# Altium project Radar_labo_EAIII_2025.PrjPcb
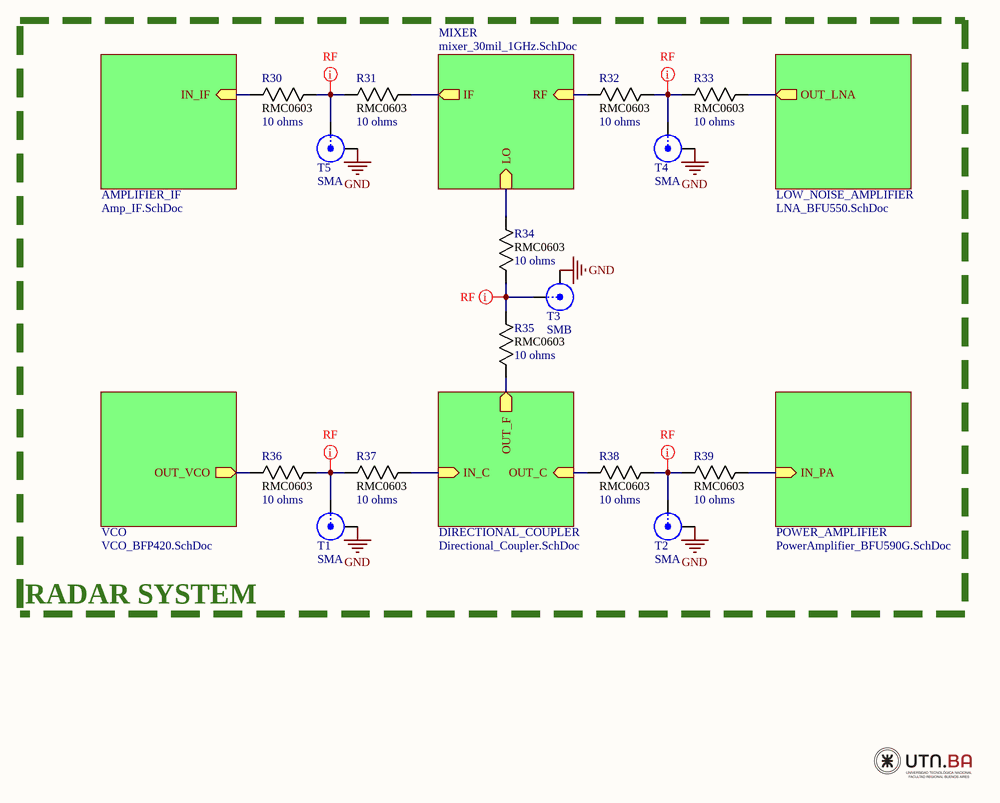
[diagram p0: Completo.SchDoc]
7 sheets, 158 parts. Net scope: hierarchical (ports join the sheet entries above them; power ports are global).
Board file: Radar_1GHz.PcbDoc
Sheets:
  Completo.SchDoc
    VCO = VCO_BFP420.SchDoc
    DIRECTIONAL_COUPLER = Directional_Coupler.SchDoc
    POWER_AMPLIFIER = PowerAmplifier_BFU590G.SchDoc
    AMPLIFIER_IF = Amp_IF.SchDoc
    MIXER = mixer_30mil_1GHz.SchDoc
    LOW_NOISE_AMPLIFIER = LNA_BFU550.SchDoc

## Sheet Completo.SchDoc: RADAR
size A4; Author: Almela; Revision: 1.2; SheetNumber: 1; SheetTotal: 7

### Parts
R30  value 10 ohms  footprint: RMC0603  [RESC1508X55N]  (hidden comment: Resistor)
R31  value 10 ohms  footprint: RMC0603  [RESC1508X55N]  (hidden comment: Resistor)
R32  value 10 ohms  footprint: RMC0603  [RESC1508X55N]  (hidden comment: Resistor)
R33  value 10 ohms  footprint: RMC0603  [RESC1508X55N]  (hidden comment: Resistor)
R34  value 10 ohms  footprint: RMC0603  [RESC1508X55N]  (hidden comment: Resistor)
R35  value 10 ohms  footprint: RMC0603  [RESC1508X55N]  (hidden comment: Resistor)
R36  value 10 ohms  footprint: RMC0603  [RESC1508X55N]  (hidden comment: Resistor)
R37  value 10 ohms  footprint: RMC0603  [RESC1508X55N]  (hidden comment: Resistor)
R38  value 10 ohms  footprint: RMC0603  [RESC1508X55N]  (hidden comment: Resistor)
R39  value 10 ohms  footprint: RMC0603  [RESC1508X55N]  (hidden comment: Resistor)
T1  SMA  [SMA-142-0701-851]
T2  SMA  [SMA-142-0701-851]
T3  SMB  [SMB_V-RJ45]
T4  SMA  [SMA-142-0701-851]
T5  SMA  [SMA-142-0701-851]

### Sub-sheets
AMPLIFIER_IF = Amp_IF.SchDoc: IN_IF (in)
DIRECTIONAL_COUPLER = Directional_Coupler.SchDoc: IN_C (in), OUT_F (out), OUT_C (in)
LOW_NOISE_AMPLIFIER = LNA_BFU550.SchDoc: OUT_LNA (out)
MIXER = mixer_30mil_1GHz.SchDoc: IF (out), RF (in), LO (in)
POWER_AMPLIFIER = PowerAmplifier_BFU590G.SchDoc: IN_PA (in)
VCO = VCO_BFP420.SchDoc: OUT_VCO (out)

### Nets
GND: T1.2(Y) T2.2(Y) T3.2(Y) T4.2(Y) T5.2(Y)
NetC4_1: R32.1 ; sheet MIXER/RF
NetC6_1: R34.2 ; sheet MIXER/LO
NetC9_2: R31.2 ; sheet MIXER/IF
NetC18_1: R36.1 ; sheet VCO/OUT_VCO
NetC27_1: R39.2 ; sheet POWER_AMPLIFIER/IN_PA
NetC37_2: R33.2 ; sheet LOW_NOISE_AMPLIFIER/OUT_LNA
NetC43_1: R37.2 ; sheet DIRECTIONAL_COUPLER/IN_C
NetC50_2: R35.1 ; sheet DIRECTIONAL_COUPLER/OUT_F
NetIN_IF_1: R30.1 ; sheet AMPLIFIER_IF/IN_IF
NetOUT_C_1: R38.1 ; sheet DIRECTIONAL_COUPLER/OUT_C
NetR30_2: R30.2 R31.1 T5.1(X)
NetR32_2: R32.2 R33.1 T4.1(X)
NetR34_1: R34.1 R35.2 T3.1(X)
NetR36_2: R36.2 R37.1 T1.1(X)
NetR38_2: R38.2 R39.1 T2.1(X)

### Layout directives
net class RF50R: NetR30_2, NetR32_2, NetR34_1, NetR36_2, NetR38_2

### Notes on the sheet
- RADAR SYSTEM

### Library data of the parts
R30-R39 = Resistor: Resistor RMC0603; Mfr_Name: Stackpole International
T1-T5 = SMB: SMB Straight Connector; LatestRevisionDate: 17-Jul-2002; LatestRevisionNote: Re-released for DXP Platform.; Publisher: Altium Limited

## Sheet VCO_BFP420.SchDoc: Voltage Controlled Oscillator
size A4; Author: Alemla; Revision: 1.2; SheetNumber: 3; SheetTotal: 7; SPICEModelCacheUMHTQHEF: <root> / <DocumentId>UMHTQHEF</DocumentId> / </root>
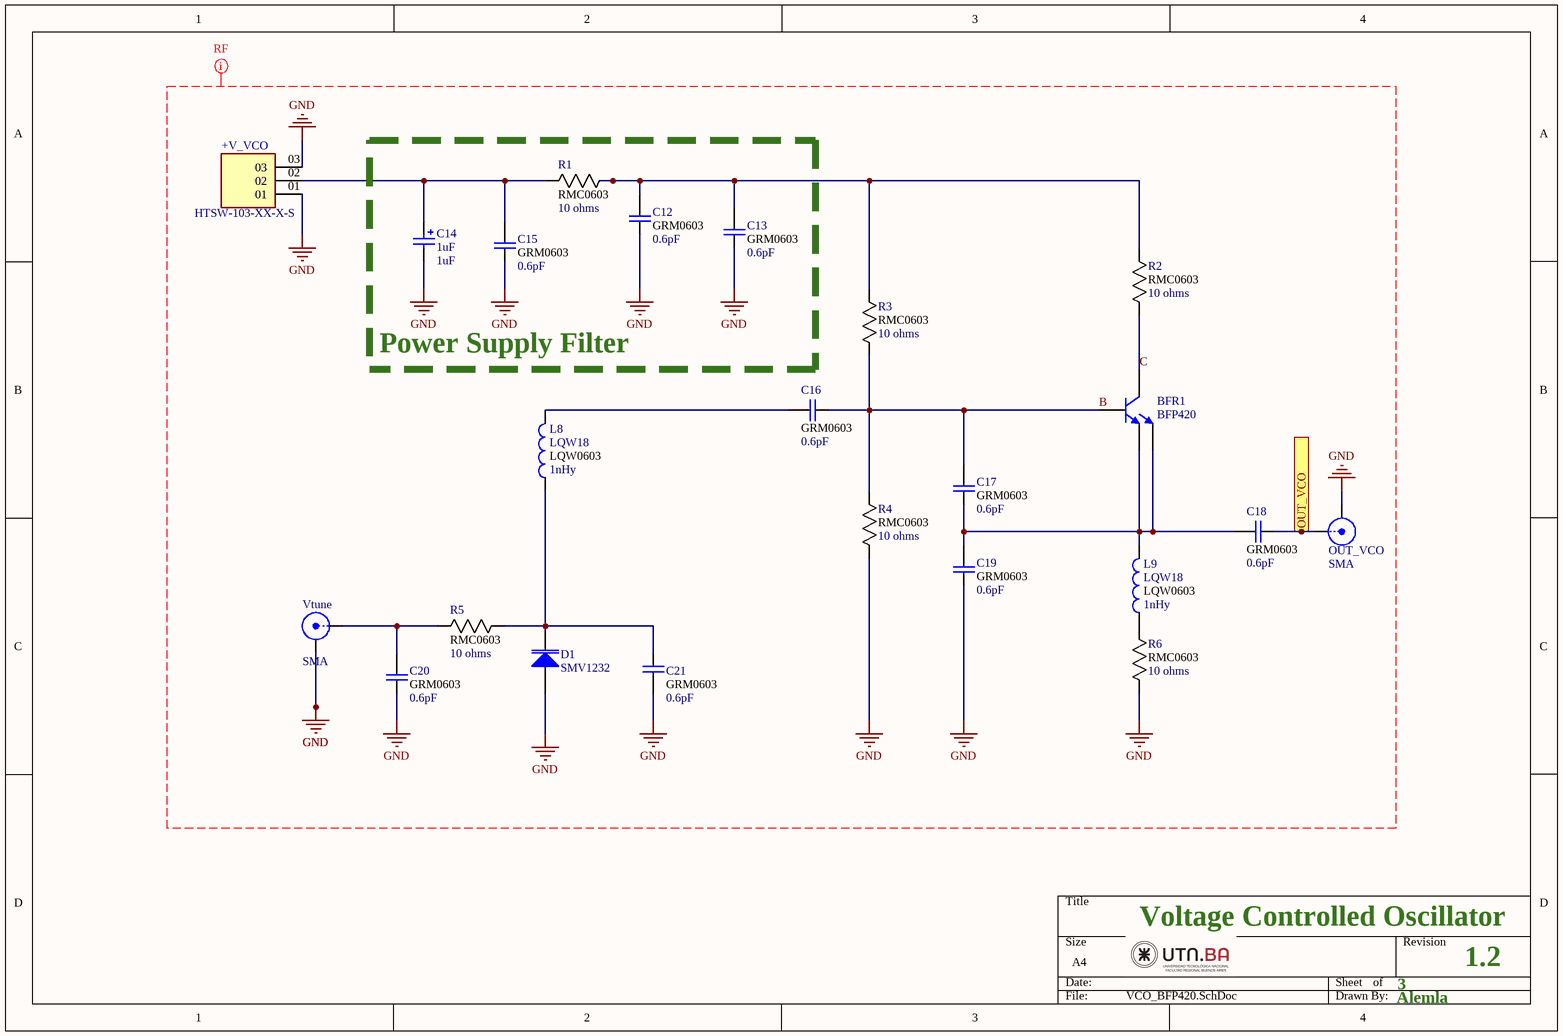
[diagram p1: VCO_BFP420.SchDoc]

### Parts
+V_VCO  HTSW-103-XX-X-S  [SAMTEC_HTSW-103-XX-X-S]
BFR1  BFP420  [SOT-343_N]
C12  value 0.6pF  footprint: GRM0603  [CAPC1608X90N]  (hidden comment: Cap 0603)
C13  value 0.6pF  footprint: GRM0603  [CAPC1608X90N]  (hidden comment: Cap 0603)
C14  1uF  [6-0805_N]
C15  value 0.6pF  footprint: GRM0603  [CAPC1608X90N]  (hidden comment: Cap 0603)
C16  value 0.6pF  footprint: GRM0603  [CAPC1608X90N]  (hidden comment: Cap 0603)
C17  value 0.6pF  footprint: GRM0603  [CAPC1608X90N]  (hidden comment: Cap 0603)
C18  value 0.6pF  footprint: GRM0603  [CAPC1608X90N]  (hidden comment: Cap 0603)
C19  value 0.6pF  footprint: GRM0603  [CAPC1608X90N]  (hidden comment: Cap 0603)
C20  value 0.6pF  footprint: GRM0603  [CAPC1608X90N]  (hidden comment: Cap 0603)
C21  value 0.6pF  footprint: GRM0603  [CAPC1608X90N]  (hidden comment: Cap 0603)
D1  SMV1232  [6-0805_N]
L8  LQW18  value 1nHy  Parameter 1: LQW0603  [INDC1608X100N]
L9  LQW18  value 1nHy  Parameter 1: LQW0603  [INDC1608X100N]
OUT_VCO  SMA  [SMA-142-0701-851]
R1  value 10 ohms  footprint: RMC0603  [RESC1508X55N]  (hidden comment: Resistor)
R2  value 10 ohms  footprint: RMC0603  [RESC1508X55N]  (hidden comment: Resistor)
R3  value 10 ohms  footprint: RMC0603  [RESC1508X55N]  (hidden comment: Resistor)
R4  value 10 ohms  footprint: RMC0603  [RESC1508X55N]  (hidden comment: Resistor)
R5  value 10 ohms  footprint: RMC0603  [RESC1508X55N]  (hidden comment: Resistor)
R6  value 10 ohms  footprint: RMC0603  [RESC1508X55N]  (hidden comment: Resistor)
Vtune  SMA  [SMA-142-0701-851]

### Ports
OUT_VCO (out)

### Nets
GND: +V_VCO.01 +V_VCO.03 C12.1 C13.1 C14.2 C15.1 C19.1 C20.1 C21.2 D1.1(A) OUT_VCO.2(Y) R4.1 R6.1 Vtune.2(Y)
B: BFR1.4(B) C16.1 C17.2 R3.1 R4.2
C: BFR1.2(C) R2.1
Net+V_VCO_02: +V_VCO.02 C14.1 C15.2 R1.1
NetBFR1_1: BFR1.1(E) BFR1.3(E) C17.1 C18.2 C19.2 L9.2
NetC12_2: C12.2 C13.2 R1.2 R2.2 R3.2
NetC16_2: C16.2 L8.2
NetC18_1: C18.1 OUT_VCO.1(X) ; port OUT_VCO
NetC20_2: C20.2 R5.2 Vtune.1(X)
NetC21_1: C21.1 D1.2(K) L8.1 R5.1
NetL9_1: L9.1 R6.2

### Layout directives
net class RF50R: B, C, GND

### Notes on the sheet
- Power Supply Filter

### Library data of the parts
+V_VCO = HTSW-103-XX-X-S: Conn Unshrouded Header HDR 3 POS 2.54mm Solder ST Top Entry Thru-Hole Bag; MP: HTSW-103-08-S-S; MF: Samtec; SnapEDA_Link: https://www.snapeda.com/parts/HTSW-103-08-S-S/Samtec/view-part/?ref=snap; Purchase-URL: https://pricing.snapeda.com/search/part/HTSW-103-08-S-S/?ref=eda; Value: *; Availability: In Stock; Check_prices: https://www.snapeda.com/parts/HTSW-103-08-S-S/Samtec/view-part/?ref=eda; Package: None; Price: None
BFR1 = BFR460: NPN Bipolar Transistor; Published: 8-Jun-2000; LatestRevisionDate: 17-Jul-2002; LatestRevisionNote: Re-released for DXP Platform.; PackageReference: TO-226-AA; Publisher: Altium Limited; PackageDescription: TO, Flat Index; 3 In-Line, Axial Leads; Body Dia. 4.8mm; Leads 0.55 x 0.51 mm (max); Code_JEDEC: TO-226-AA
C12 C13 C15-C21 = Cap: Capacitor GRM18 0603; Published: 8-Jun-2000; LatestRevisionDate: 17-Jul-2002; LatestRevisionNote: Re-released for DXP Platform.; PackageReference: POLAR0.8; Publisher: Altium Limited; PackageDescription: Polarized Capacitor; 2 Leads; Supplier 1: Mouser
C14 = Cap Pol2_1: Polarized Capacitor (Axial); Published: 8-Jun-2000; LatestRevisionDate: 17-Jul-2002; LatestRevisionNote: Re-released for DXP Platform.; PackageReference: POLAR0.8; Publisher: Altium Limited; PackageDescription: Polarized Capacitor; 2 Leads; Value: 1uF
D1 = D Varactor: Variable Capacitance Diode; Note: Pin 2 is not connected and not drawn.; Published: 8-Jun-2000; LatestRevisionDate: 29-May-2009; LatestRevisionNote: IPC-7351 Footprint Added.; DatasheetVersion: Jan-1998; PackageVersion: 1996; PackageReference: SOT23A; Publisher: Altium Limited; PackageDescription: 3-Pin SOT-23 Package 0.95 mm Pitch, 2.3 mm Lead Span - Reverse Pinning; ComponentLink1Description: Manufacturer Link; ComponentLink1URL: http://www.zetex.com/
L8 L9 = LQW18: Ind RF Chip Wirewound 18nH 5% 100MHz 40Q-Factor 550mA 0603 Paper T/R; MP: LQW18AN18NJ00D; Package: None; Price: None; Availability: Unavailable
OUT_VCO Vtune = SMA: SMA Straight Connector; LatestRevisionDate: 17-Jul-2002; LatestRevisionNote: Re-released for DXP Platform.; Publisher: Altium Limited
R1-R6 = Resistor: as R30 on sheet Completo

## Sheet Directional_Coupler.SchDoc: Directional Coupler
size A4; Author: Almela; Revision: 1.2; SheetNumber: 6; SheetTotal: 7
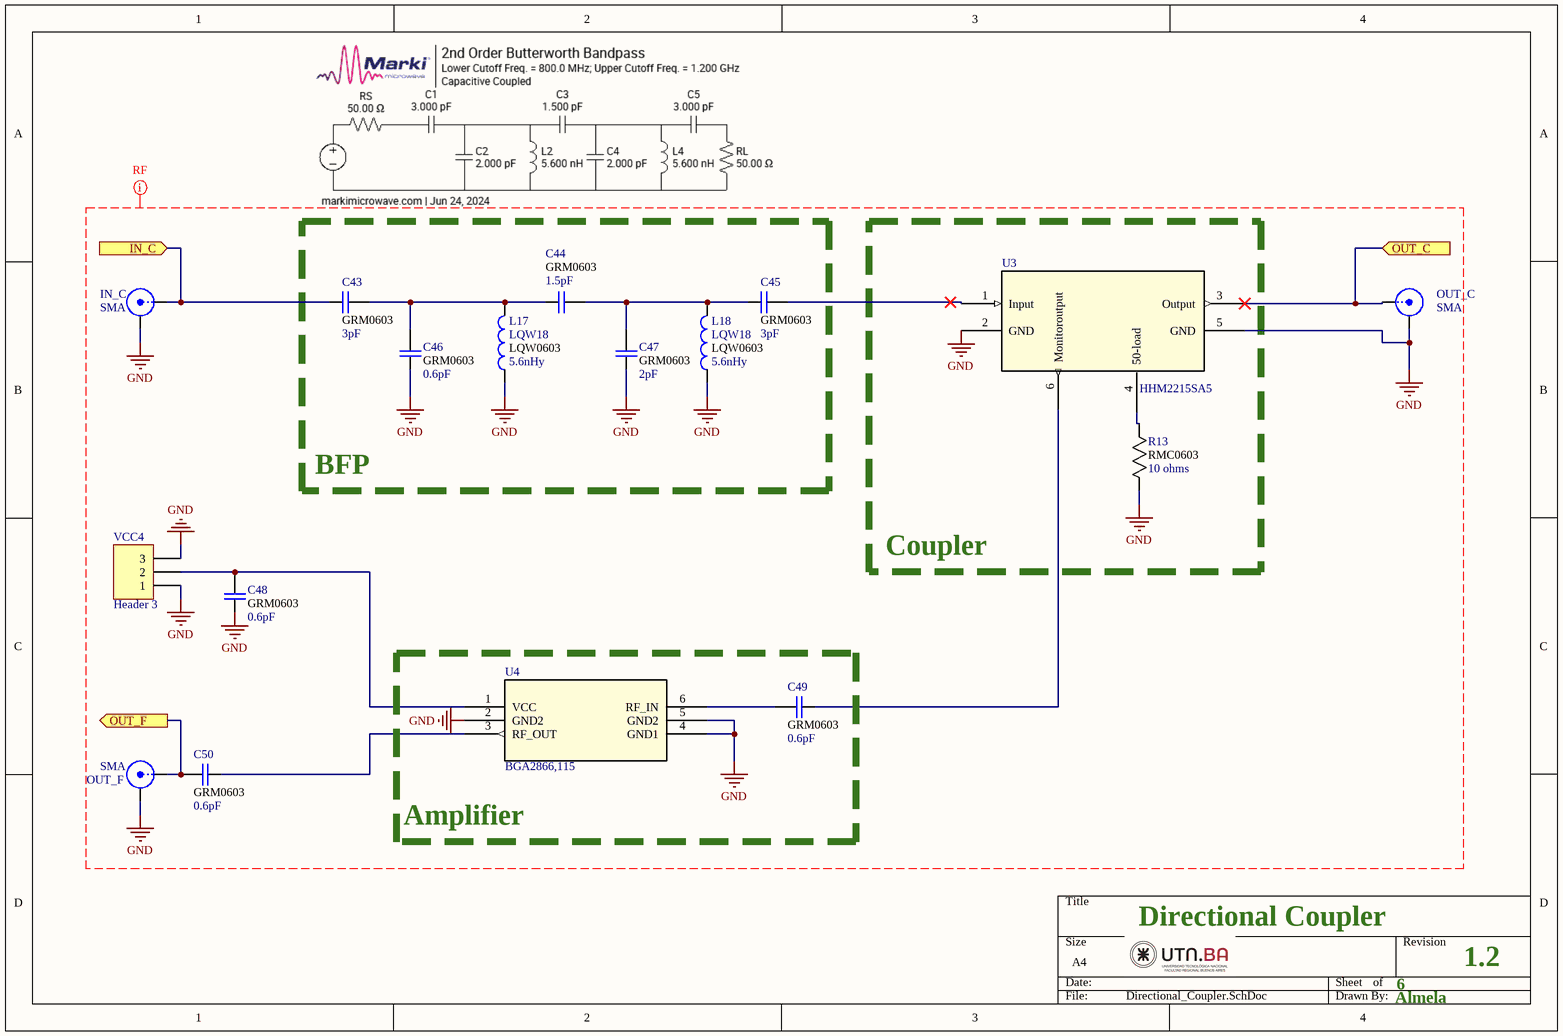
[diagram p2: Directional_Coupler.SchDoc]

### Parts
C43  value 3pF  footprint: GRM0603  [CAPC1608X90N]  (hidden comment: Cap 0603)
C44  value 1.5pF  footprint: GRM0603  [CAPC1608X90N]  (hidden comment: Cap 0603)
C45  value 3pF  footprint: GRM0603  [CAPC1608X90N]  (hidden comment: Cap 0603)
C46  value 0.6pF  footprint: GRM0603  [CAPC1608X90N]  (hidden comment: Cap 0603)
C47  value 2pF  footprint: GRM0603  [CAPC1608X90N]  (hidden comment: Cap 0603)
C48  value 0.6pF  footprint: GRM0603  [CAPC1608X90N]  (hidden comment: Cap 0603)
C49  value 0.6pF  footprint: GRM0603  [CAPC1608X90N]  (hidden comment: Cap 0603)
C50  value 0.6pF  footprint: GRM0603  [CAPC1608X90N]  (hidden comment: Cap 0603)
IN_C  SMA  [SMA-142-0701-851]
L17  LQW18  value 5.6nHy  Parameter 1: LQW0603  [INDC1608X100N]
L18  LQW18  value 5.6nHy  Parameter 1: LQW0603  [INDC1608X100N]
OUT_C  SMA  [SMA-142-0701-851]
OUT_F  SMA  [SMA-142-0701-851]
R13  value 10 ohms  footprint: RMC0603  [RESC1508X55N]  (hidden comment: Resistor)
U3  HHM2215SA5  [HHM-6_1P6X0P8]
U4  BGA2866,115  [SOT363_NXP]
VCC4  Header 3  [HDR1X3]

### Blocks framed on the sheet
BFP: C43-C47 L17 L18
Coupler: R13 U3
Amplifier: C49 U4

### Ports
IN_C (in), OUT_C (in), OUT_F (out)

### Nets
GND: C46.1 C47.1 C48.1 IN_C.2(Y) L17.1 L18.1 OUT_C.2(Y) OUT_F.2(Y) R13.1 U3.2(GND) U3.5(GND) U4.2(GND2) U4.4(GND1) U4.5(GND2) VCC4.1 VCC4.3
NetC43_1: C43.1 IN_C.1(X) ; port IN_C
NetC43_2: C43.2 C44.1 C46.2 L17.2
NetC44_2: C44.2 C45.1 C47.2 L18.2
NetC45_2: C45.2 U3.1(Input)
NetC48_2: C48.2 U4.1(VCC) VCC4.2
NetC49_1: C49.1 U3.6(Monitoroutput)
NetC49_2: C49.2 U4.6(RF_IN)
NetC50_1: C50.1 U4.3(RF_OUT)
NetC50_2: C50.2 OUT_F.1(X) ; port OUT_F
NetOUT_C_1: OUT_C.1(X) U3.3(Output) ; port OUT_C
NetR13_2: R13.2 U3.4(50-load)

### Layout directives
net class RF50R: GND

### Library data of the parts
C43-C50 = Cap: Capacitor GRM18 0603; Published: 8-Jun-2000; LatestRevisionDate: 17-Jul-2002; LatestRevisionNote: Re-released for DXP Platform.; PackageReference: POLAR0.8; Publisher: Altium Limited; PackageDescription: Polarized Capacitor; 2 Leads; Supplier 1: Mouser
IN_C OUT_C = SMA: SMA Straight Connector; LatestRevisionDate: 17-Jul-2002; LatestRevisionNote: Re-released for DXP Platform.; Publisher: Altium Limited
L17 L18 = LQW18: as L8 on sheet VCO_BFP420; Package: None; Price: None; Availability: Unavailable
OUT_F = SMB: SMB Straight Connector; LatestRevisionDate: 17-Jul-2002; LatestRevisionNote: Re-released for DXP Platform.; Publisher: Altium Limited
R13 = Resistor: as R30 on sheet Completo
U3 = HHM2215SA5: No Description Available; Mfr_Name: TDK; RefDes: RefDes; Type: Type
U4 = BGA2866,115: No Description Available; Mfr_Name: NXP; RefDes: RefDes; Type: Type
VCC4 = Header 3: Header, 3-Pin; LatestRevisionDate: 17-Jul-2002; LatestRevisionNote: Re-released for DXP Platform.; Publisher: Altium Limited

## Sheet PowerAmplifier_BFU590G.SchDoc: Power Amplifier
size A4; Author: Almela; Revision: 1.2; SheetNumber: 4; SheetTotal: 7
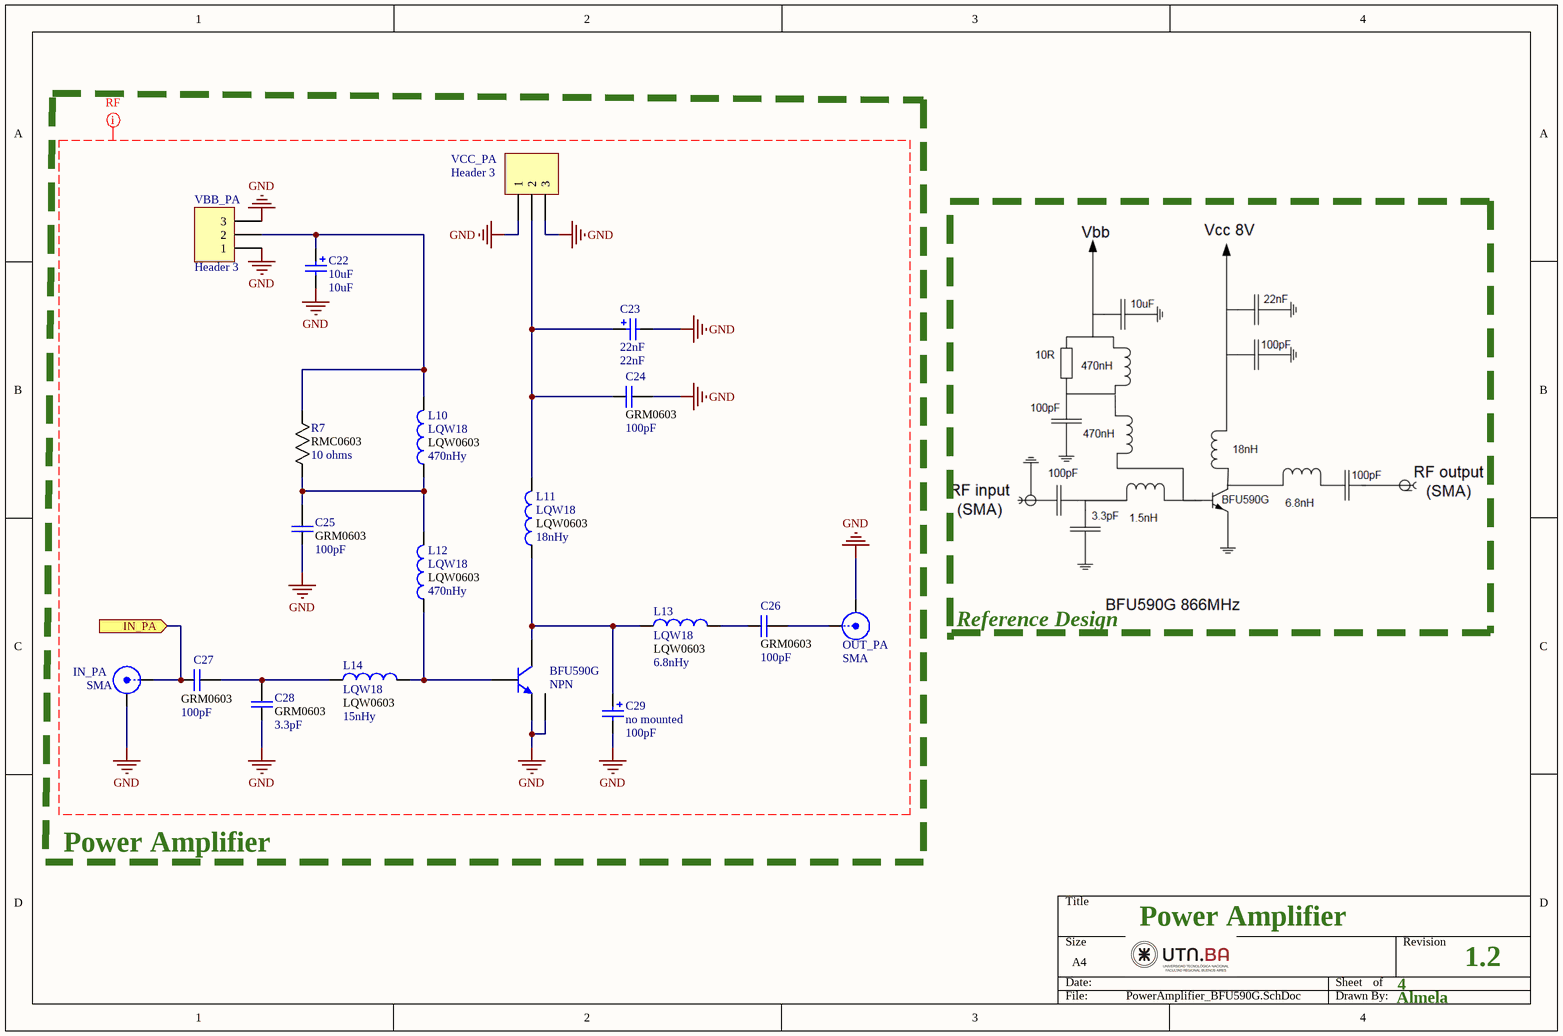
[diagram p3: PowerAmplifier_BFU590G.SchDoc]

### Parts
BFU590G  NPN  [SOT223_L]
C22  10uF  [6-0805_N]
C23  22nF  [6-0805_N]
C24  value 100pF  footprint: GRM0603  [CAPC1608X90N]  (hidden comment: Cap 0603)
C25  value 100pF  footprint: GRM0603  [CAPC1608X90N]  (hidden comment: Cap 0603)
C26  value 100pF  footprint: GRM0603  [CAPC1608X90N]  (hidden comment: Cap 0603)
C27  value 100pF  footprint: GRM0603  [CAPC1608X90N]  (hidden comment: Cap 0603)
C28  value 3.3pF  footprint: GRM0603  [CAPC1608X90N]  (hidden comment: Cap 0603)
C29  no mounted  value 100pF  [6-0805_N]
IN_PA  SMA  [SMA-142-0701-851]
L10  LQW18  value 470nHy  Parameter 1: LQW0603  [INDC1608X100N]
L11  LQW18  value 18nHy  Parameter 1: LQW0603  [INDC1608X100N]
L12  LQW18  value 470nHy  Parameter 1: LQW0603  [INDC1608X100N]
L13  LQW18  value 6.8nHy  Parameter 1: LQW0603  [INDC1608X100N]
L14  LQW18  value 15nHy  Parameter 1: LQW0603  [INDC1608X100N]
OUT_PA  SMA  [SMA-142-0701-851]
R7  value 10 ohms  footprint: RMC0603  [RESC1508X55N]  (hidden comment: Resistor)
VBB_PA  Header 3  [HDR1X3]
VCC_PA  Header 3  [HDR1X3]

### Ports
IN_PA (in)

### Nets
GND: BFU590G.1(E) BFU590G.3(E) C22.2 C23.2 C24.2 C25.1 C28.1 C29.2 IN_PA.2(Y) OUT_PA.2(Y) VBB_PA.1 VBB_PA.3 VCC_PA.1 VCC_PA.3
NetBFU590G_2: BFU590G.2(B) L12.1 L14.2
NetBFU590G_4: BFU590G.4(C) C29.1 L11.1 L13.1
NetC22_1: C22.1 L10.2 R7.2 VBB_PA.2
NetC23_1: C23.1 C24.1 L11.2 VCC_PA.2
NetC25_2: C25.2 L10.1 L12.2 R7.1
NetC26_1: C26.1 L13.2
NetC26_2: C26.2 OUT_PA.1(X)
NetC27_1: C27.1 IN_PA.1(X) ; port IN_PA
NetC27_2: C27.2 C28.2 L14.1

### Layout directives
net class RF50R: GND

### Notes on the sheet
- Reference Design
- Power Amplifier

### Library data of the parts
BFU590G = BFU590G: NPN Bipolar Transistor; Published: 8-Jun-2000; LatestRevisionDate: 17-Jul-2002; LatestRevisionNote: Re-released for DXP Platform.; PackageReference: TO-226-AA; Publisher: Altium Limited; PackageDescription: TO, Flat Index; 3 In-Line, Axial Leads; Body Dia. 4.8mm; Leads 0.55 x 0.51 mm (max); Code_JEDEC: TO-226-AA
C22 = Cap Pol2_7: Polarized Capacitor (Axial); Published: 8-Jun-2000; LatestRevisionDate: 17-Jul-2002; LatestRevisionNote: Re-released for DXP Platform.; PackageReference: POLAR0.8; Publisher: Altium Limited; PackageDescription: Polarized Capacitor; 2 Leads; Value: 10uF
C23 C29 = Cap Pol2_1: Polarized Capacitor (Axial); Published: 8-Jun-2000; LatestRevisionDate: 17-Jul-2002; LatestRevisionNote: Re-released for DXP Platform.; PackageReference: POLAR0.8; Publisher: Altium Limited; PackageDescription: Polarized Capacitor; 2 Leads
  C23: Value: 22nF
C24-C28 = Cap: Capacitor GRM18 0603; Published: 8-Jun-2000; LatestRevisionDate: 17-Jul-2002; LatestRevisionNote: Re-released for DXP Platform.; PackageReference: POLAR0.8; Publisher: Altium Limited; PackageDescription: Polarized Capacitor; 2 Leads; Supplier 1: Mouser
IN_PA OUT_PA = SMA: SMA Straight Connector; LatestRevisionDate: 17-Jul-2002; LatestRevisionNote: Re-released for DXP Platform.; Publisher: Altium Limited
L10-L14 = LQW18: as L8 on sheet VCO_BFP420; Package: None; Price: None; Availability: Unavailable
R7 = Resistor: as R30 on sheet Completo
VBB_PA VCC_PA = Header 3: Header, 3-Pin; LatestRevisionDate: 17-Jul-2002; LatestRevisionNote: Re-released for DXP Platform.; Publisher: Altium Limited

## Sheet Amp_IF.SchDoc: IF Amplifier
size A4; Author: Almela; Revision: 1.2; SheetNumber: 7; SheetTotal: 7
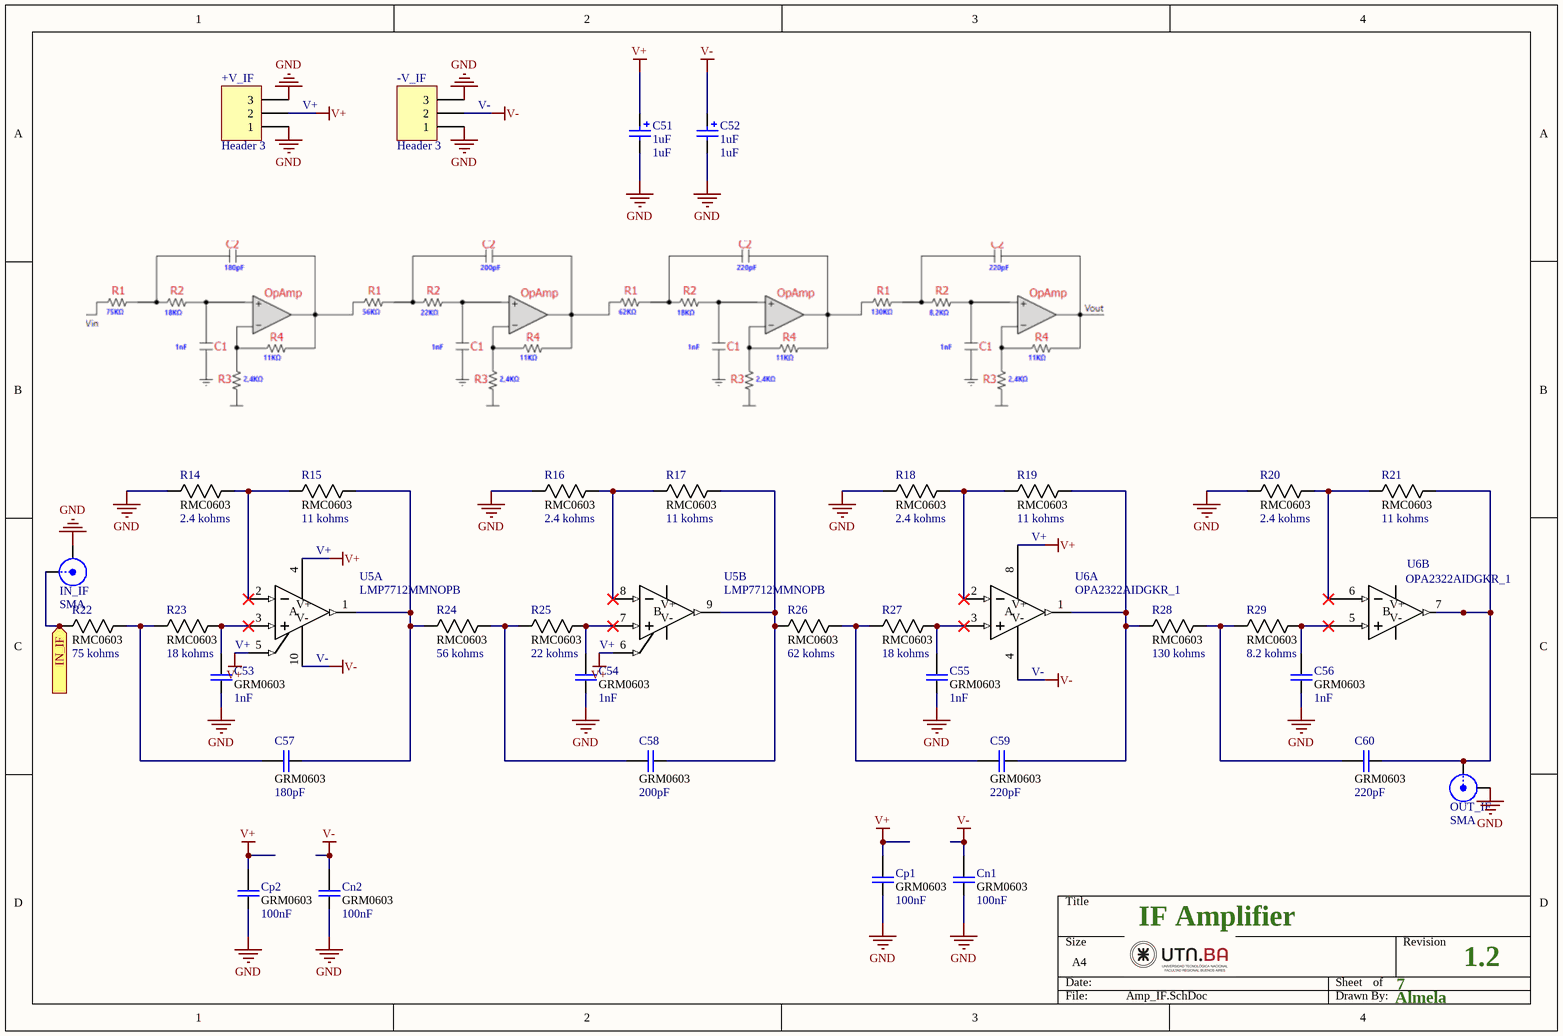
[diagram p4: Amp_IF.SchDoc]

### Parts
+V_IF  Header 3  [HDR1X3]
-V_IF  Header 3  [HDR1X3]
C51  1uF  [6-0805_N]
C52  1uF  [6-0805_N]
C53  value 1nF  footprint: GRM0603  [CAPC1608X90N]  (hidden comment: Cap 0603)
C54  value 1nF  footprint: GRM0603  [CAPC1608X90N]  (hidden comment: Cap 0603)
C55  value 1nF  footprint: GRM0603  [CAPC1608X90N]  (hidden comment: Cap 0603)
C56  value 1nF  footprint: GRM0603  [CAPC1608X90N]  (hidden comment: Cap 0603)
C57  value 180pF  footprint: GRM0603  [CAPC1608X90N]  (hidden comment: Cap 0603)
C58  value 200pF  footprint: GRM0603  [CAPC1608X90N]  (hidden comment: Cap 0603)
C59  value 220pF  footprint: GRM0603  [CAPC1608X90N]  (hidden comment: Cap 0603)
C60  value 220pF  footprint: GRM0603  [CAPC1608X90N]  (hidden comment: Cap 0603)
Cn1  value 100nF  footprint: GRM0603  [CAPC1608X90N]  (hidden comment: Cap 0603)
Cn2  value 100nF  footprint: GRM0603  [CAPC1608X90N]  (hidden comment: Cap 0603)
Cp1  value 100nF  footprint: GRM0603  [CAPC1608X90N]  (hidden comment: Cap 0603)
Cp2  value 100nF  footprint: GRM0603  [CAPC1608X90N]  (hidden comment: Cap 0603)
IN_IF  SMA  [SMA-142-0701-851]
OUT_IF  SMA  [SMA-142-0701-851]
R14  value 2.4 kohms  footprint: RMC0603  [RESC1508X55N]  (hidden comment: Resistor)
R15  value 11 kohms  footprint: RMC0603  [RESC1508X55N]  (hidden comment: Resistor)
R16  value 2.4 kohms  footprint: RMC0603  [RESC1508X55N]  (hidden comment: Resistor)
R17  value 11 kohms  footprint: RMC0603  [RESC1508X55N]  (hidden comment: Resistor)
R18  value 2.4 kohms  footprint: RMC0603  [RESC1508X55N]  (hidden comment: Resistor)
R19  value 11 kohms  footprint: RMC0603  [RESC1508X55N]  (hidden comment: Resistor)
R20  value 2.4 kohms  footprint: RMC0603  [RESC1508X55N]  (hidden comment: Resistor)
R21  value 11 kohms  footprint: RMC0603  [RESC1508X55N]  (hidden comment: Resistor)
R22  value 75 kohms  footprint: RMC0603  [RESC1508X55N]  (hidden comment: Resistor)
R23  value 18 kohms  footprint: RMC0603  [RESC1508X55N]  (hidden comment: Resistor)
R24  value 56 kohms  footprint: RMC0603  [RESC1508X55N]  (hidden comment: Resistor)
R25  value 22 kohms  footprint: RMC0603  [RESC1508X55N]  (hidden comment: Resistor)
R26  value 62 kohms  footprint: RMC0603  [RESC1508X55N]  (hidden comment: Resistor)
R27  value 18 kohms  footprint: RMC0603  [RESC1508X55N]  (hidden comment: Resistor)
R28  value 130 kohms  footprint: RMC0603  [RESC1508X55N]  (hidden comment: Resistor)
R29  value 8.2 kohms  footprint: RMC0603  [RESC1508X55N]  (hidden comment: Resistor)
U5  LMP7712MMNOPB  [SOP50P490X110-10N]  (parts A,B of 2)
U6  OPA2322AIDGKR_1  [DGK8]  (parts A,B of 2)

### Ports
IN_IF (in)

### Nets
GND: +V_IF.1 +V_IF.3 -V_IF.1 -V_IF.3 C51.2 C52.2 C53.1 C54.1 C55.1 C56.1 Cn1.1 Cn2.1 Cp1.1 Cp2.1 IN_IF.2(Y) OUT_IF.2(Y) R14.1 R16.1 R18.1 R20.1
V+: +V_IF.2 C51.1 Cp1.2 Cp2.2 U5.4(V-) U5.5(SD1) U5.6(SD2) U6.8(V+)
V-: -V_IF.2 C52.1 Cn1.2 Cn2.2 U5.10(V+) U6.4(V-)
NetC53_2: C53.2 R23.2 U5.3(IN+)
NetC54_2: C54.2 R25.2 U5.7(IN+)
NetC55_2: C55.2 R27.2 U6.3(IN+)
NetC56_2: C56.2 R29.2 U6.5(INB+)
NetC57_1: C57.1 R15.2 R24.1 U5.1(OUT)
NetC57_2: C57.2 R22.2 R23.1
NetC58_1: C58.1 R17.2 R26.1 U5.9(OUT)
NetC58_2: C58.2 R24.2 R25.1
NetC59_1: C59.1 R19.2 R28.1 U6.1(OUT)
NetC59_2: C59.2 R26.2 R27.1
NetC60_1: C60.1 OUT_IF.1(X) R21.2 U6.7(OUTB)
NetC60_2: C60.2 R28.2 R29.1
NetIN_IF_1: IN_IF.1(X) R22.1 ; port IN_IF
NetR14_2: R14.2 R15.1 U5.2(IN-)
NetR16_2: R16.2 R17.1 U5.8(IN-)
NetR18_2: R18.2 R19.1 U6.2(IN-)
NetR20_2: R20.2 R21.1 U6.6(INB-)

### Notes on the sheet
- (near +V_IF) V+
- (near -V_IF) V-
- (near U5) V+
- V+
- (near U5) V-
- (near U6) V-
- (in symbol LMP7712MMNOPB, part A) A
- (in symbol LMP7712MMNOPB, part B) B
- (in symbol OPA2322AIDGKR_1, part A) A
- (in symbol OPA2322AIDGKR_1, part B) B

### Library data of the parts
+V_IF -V_IF = Header 3: Header, 3-Pin; LatestRevisionDate: 17-Jul-2002; LatestRevisionNote: Re-released for DXP Platform.; Publisher: Altium Limited
C51 C52 = Cap Pol2_1: Polarized Capacitor (Axial); Published: 8-Jun-2000; LatestRevisionDate: 17-Jul-2002; LatestRevisionNote: Re-released for DXP Platform.; PackageReference: POLAR0.8; Publisher: Altium Limited; PackageDescription: Polarized Capacitor; 2 Leads; Value: 1uF
C53-C60 Cn1 Cn2 Cp1 Cp2 = Cap: Capacitor GRM18 0603; Published: 8-Jun-2000; LatestRevisionDate: 17-Jul-2002; LatestRevisionNote: Re-released for DXP Platform.; PackageReference: POLAR0.8; Publisher: Altium Limited; PackageDescription: Polarized Capacitor; 2 Leads; Supplier 1: Mouser
IN_IF OUT_IF = SMA: SMA Straight Connector; LatestRevisionDate: 17-Jul-2002; LatestRevisionNote: Re-released for DXP Platform.; Publisher: Altium Limited
R14-R29 = Resistor: as R30 on sheet Completo
U5 = LMP7712MMNOPB: No Description Available; Mfr_Name: Texas Instruments; Manufacturer: NationalSemiconductor; Characteristics: LMP7712MM18VPrecisonDualLowNoiseCMOSInputOpAmpwithShutdown; CompType: OpAmpIC; TaMin_C: -400; TaMax_C: 1250; ComponentLink1DescBC: LMP7712Datasheet; ComponentLink2DescA4: LMP7712WebPage; ComponentLink3DescAC: MUB10APackageWebPage; SymbolVersion: 2008-07-09; PartNumber: LMP7712MM; PackageDescription: 10LeadMSOP; PackageReference: MUB10A_L; RoHS: O; ComponentLink1URL: http//wwwnationalcom/ds/LM/LMP7712pdf; ComponentLink2URL: http//wwwnationalcom/pf/LM/LMP7712html; ComponentLink3URL: http//wwwnationalcom/packaging/folders/mub10ahtml; Version: B1608; LatestRevisionDate: 2009-03-16; LatestRevisionNote: MassUpdate; Publisher: NationalSemiconductor; Published: 2009-03-16
U6 = OPA2322AIDGKR_1: No Description Available; Mfr_Name: Texas Instruments; RefDes: RefDes; Type: Type

## Sheet mixer_30mil_1GHz.SchDoc: Mixer
size A4; Author: Almela; Revision: 1.2; SheetNumber: 2; SheetTotal: 7
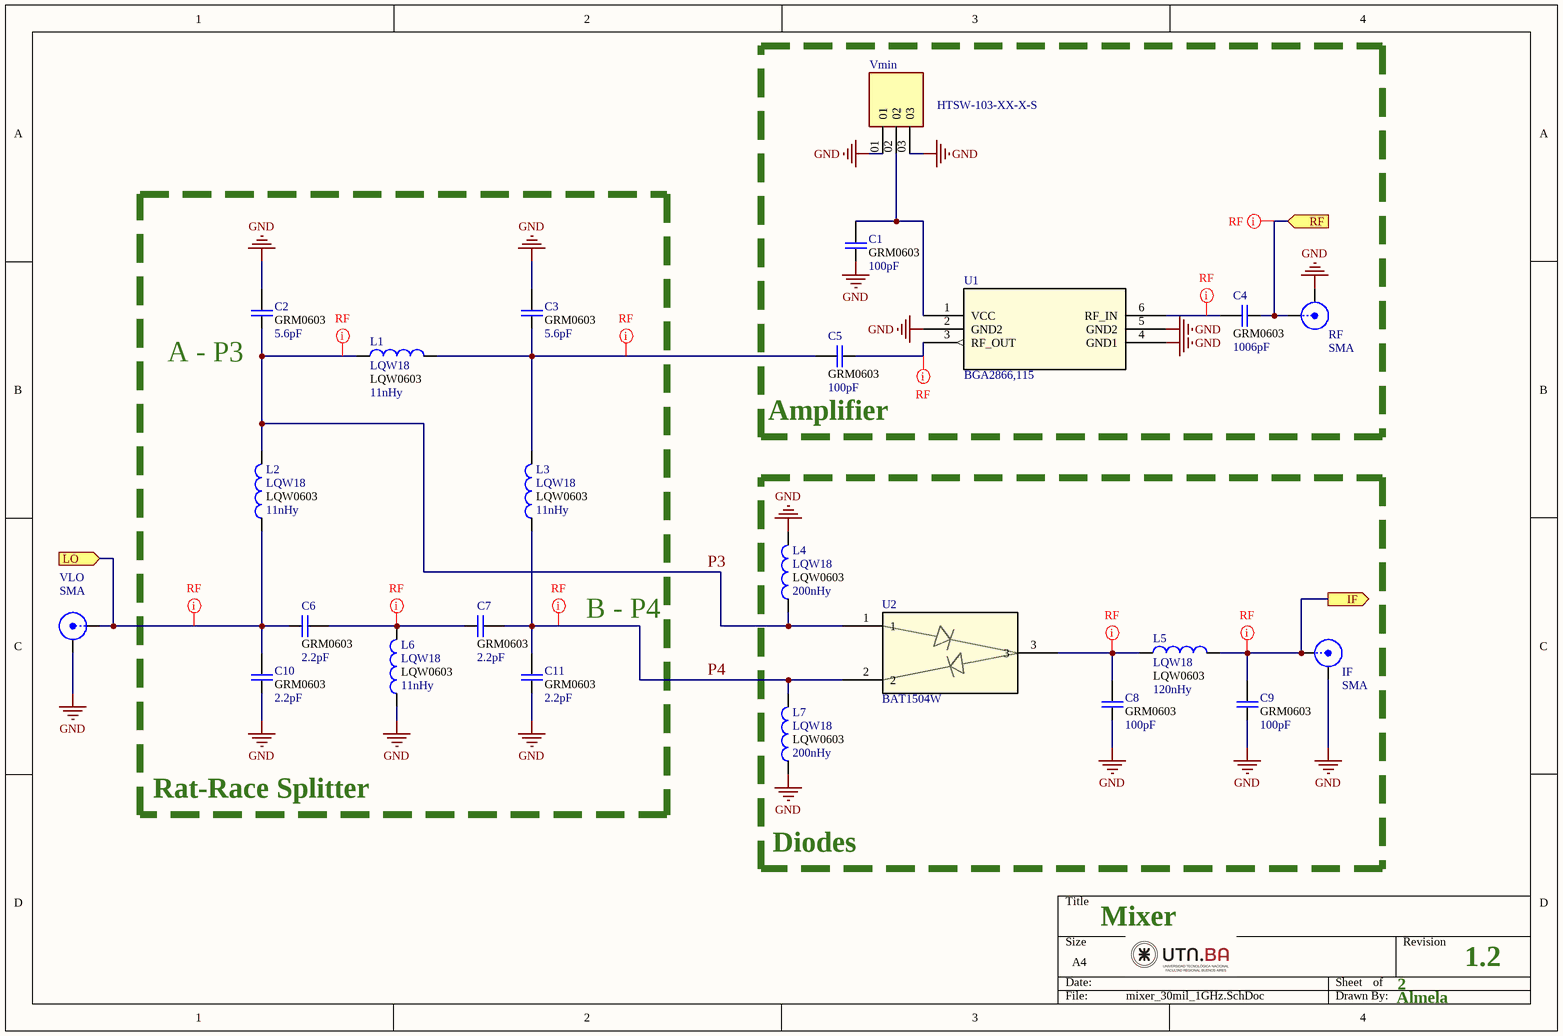
[diagram p5: mixer_30mil_1GHz.SchDoc]

### Parts
C1  value 100pF  footprint: GRM0603  [CAPC1608X90N]  (hidden comment: Cap 0603)
C2  value 5.6pF  footprint: GRM0603  [CAPC1608X90N]  (hidden comment: Cap 0603)
C3  value 5.6pF  footprint: GRM0603  [CAPC1608X90N]  (hidden comment: Cap 0603)
C4  value 1006pF  footprint: GRM0603  [CAPC1608X90N]  (hidden comment: Cap 0603)
C5  value 100pF  footprint: GRM0603  [CAPC1608X90N]  (hidden comment: Cap 0603)
C6  value 2.2pF  footprint: GRM0603  [CAPC1608X90N]  (hidden comment: Cap 0603)
C7  value 2.2pF  footprint: GRM0603  [CAPC1608X90N]  (hidden comment: Cap 0603)
C8  value 100pF  footprint: GRM0603  [CAPC1608X90N]  (hidden comment: Cap 0603)
C9  value 100pF  footprint: GRM0603  [CAPC1608X90N]  (hidden comment: Cap 0603)
C10  value 2.2pF  footprint: GRM0603  [CAPC1608X90N]  (hidden comment: Cap 0603)
C11  value 2.2pF  footprint: GRM0603  [CAPC1608X90N]  (hidden comment: Cap 0603)
IF  SMA  [SMA-142-0701-851]
L1  LQW18  value 11nHy  Parameter 1: LQW0603  [INDC1608X100N]
L2  LQW18  value 11nHy  Parameter 1: LQW0603  [INDC1608X100N]
L3  LQW18  value 11nHy  Parameter 1: LQW0603  [INDC1608X100N]
L4  LQW18  value 200nHy  Parameter 1: LQW0603  [INDC1608X100N]
L5  LQW18  value 120nHy  Parameter 1: LQW0603  [INDC1608X100N]
L6  LQW18  value 11nHy  Parameter 1: LQW0603  [INDC1608X100N]
L7  LQW18  value 200nHy  Parameter 1: LQW0603  [INDC1608X100N]
RF  SMA  [SMA-142-0701-851]
U1  BGA2866,115  [SOT363_NXP]
U2  BAT1504W  [SOT_327XTSA1_INF]
VLO  SMA  [SMA-142-0701-851]
Vmin  HTSW-103-XX-X-S  [SAMTEC_HTSW-103-XX-X-S]

### Blocks framed on the sheet
Amplifier: C1 C4 C5 RF U1 Vmin
Diodes: C8 C9 IF L4 L5 L7 U2

### Ports
IF (out), LO (in), RF (in)

### Nets
GND: C1.1 C2.2 C3.2 C8.1 C9.1 C10.1 C11.1 IF.2(Y) L4.2 L6.1 L7.1 RF.2(Y) U1.2(GND2) U1.4(GND1) U1.5(GND2) VLO.2(Y) Vmin.01 Vmin.03
P3: C2.1 L1.1 L2.2 L4.1 U2.1
P4: C7.2 C11.2 L3.1 L7.2 U2.2
NetC1_2: C1.2 U1.1(VCC) Vmin.02
NetC3_1: C3.1 C5.2 L1.2 L3.2
NetC4_1: C4.1 RF.1(X) ; port RF
NetC4_2: C4.2 U1.6(RF_IN)
NetC5_1: C5.1 U1.3(RF_OUT)
NetC6_1: C6.1 C10.2 L2.1 VLO.1(X) ; port LO
NetC6_2: C6.2 C7.1 L6.2
NetC8_2: C8.2 L5.1 U2.3
NetC9_2: C9.2 IF.1(X) L5.2 ; port IF

### Layout directives
net class RF50R: NetC3_1, NetC4_1, NetC4_2, NetC5_1, NetC6_1, NetC6_2, NetC8_2, NetC9_2, P3, P4

### Notes on the sheet
- (near C2) A - P3
- B - P4
- Rat-Race Splitter

### Library data of the parts
C1-C11 = Cap: Capacitor GRM18 0603; Published: 8-Jun-2000; LatestRevisionDate: 17-Jul-2002; LatestRevisionNote: Re-released for DXP Platform.; PackageReference: POLAR0.8; Publisher: Altium Limited; PackageDescription: Polarized Capacitor; 2 Leads; Supplier 1: Mouser
IF RF VLO = SMB: SMB Straight Connector; LatestRevisionDate: 17-Jul-2002; LatestRevisionNote: Re-released for DXP Platform.; Publisher: Altium Limited
L1-L7 = LQW18: as L8 on sheet VCO_BFP420; Package: None; Price: None; Availability: Unavailable
U1 = BGA2866,115: No Description Available; Mfr_Name: NXP; RefDes: RefDes; Type: Type
U2 = BAT1504W: Diodo; Mfr_Name: Infineon; RefDes: RefDes; Type: Type
Vmin = HTSW-103-XX-X-S: as +V_VCO on sheet VCO_BFP420; SnapEDA_Link: https://www.snapeda.com/parts/HTSW-103-08-S-S/Samtec/view-part/?ref=snap; Purchase-URL: https://pricing.snapeda.com/search/part/HTSW-103-08-S-S/?ref=eda; Value: *; Availability: In Stock; Check_prices: https://www.snapeda.com/parts/HTSW-103-08-S-S/Samtec/view-part/?ref=eda; Package: None; Price: None

## Sheet LNA_BFU550.SchDoc: Low Noise Amplifier
size A4; Author: Almela; Revision: 1.2; SheetNumber: 5; SheetTotal: 7
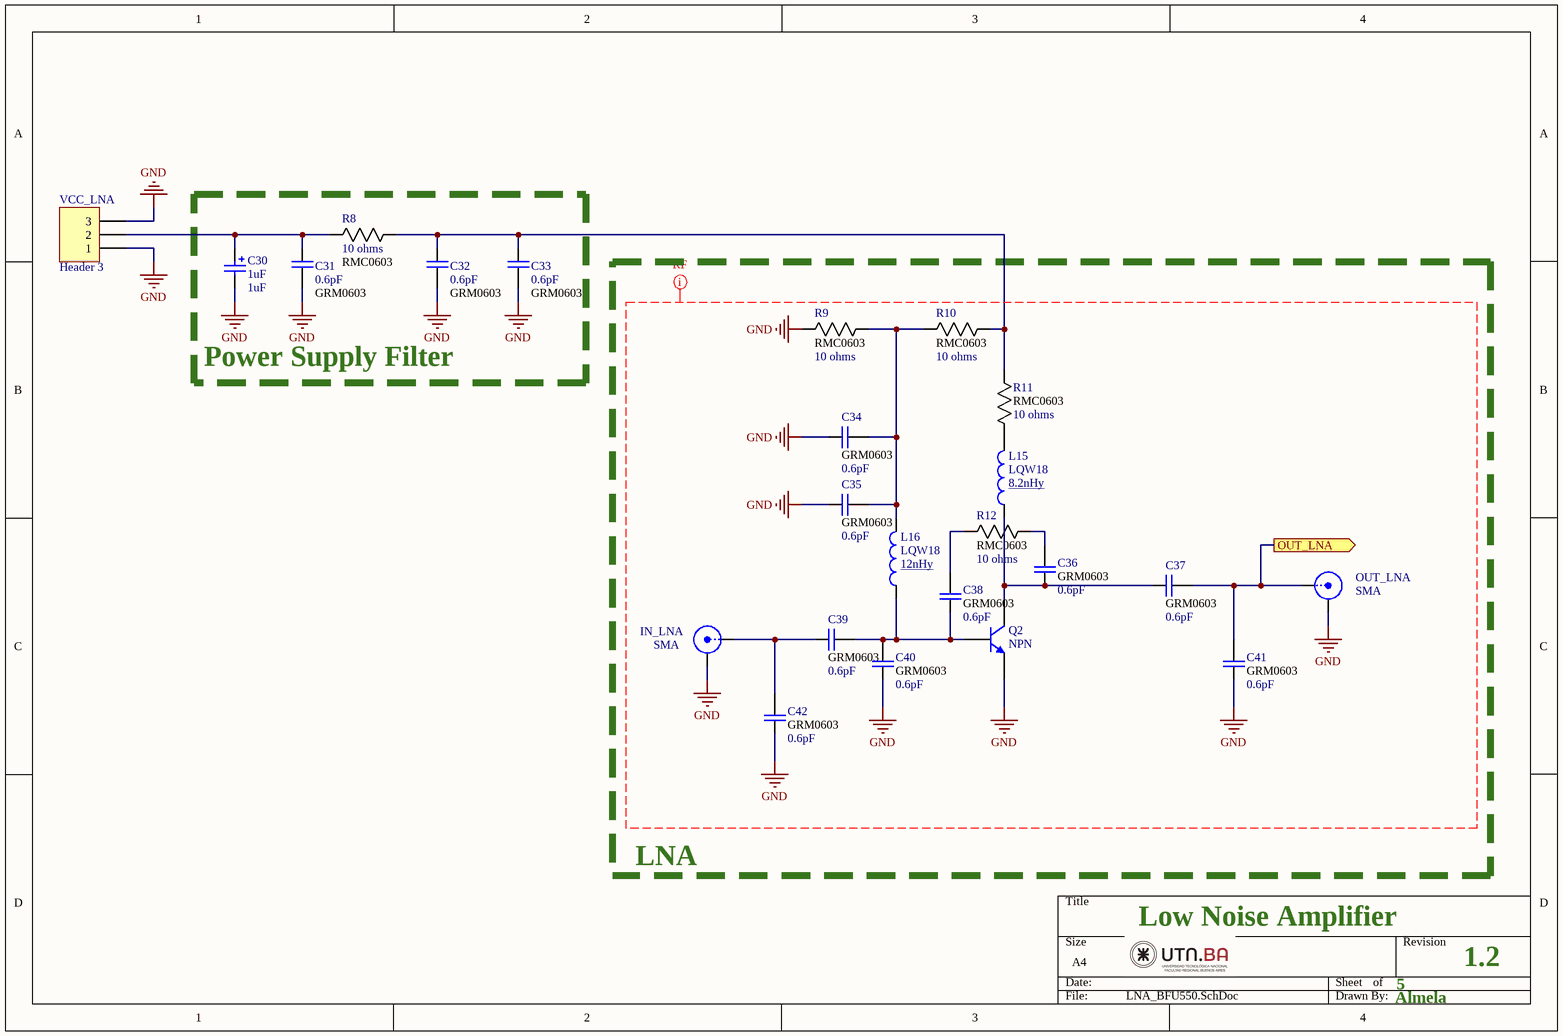
[diagram p6: LNA_BFU550.SchDoc]

### Parts
C30  1uF  [6-0805_N]
C31  value 0.6pF  footprint: GRM0603  [CAPC1608X90N]  (hidden comment: Cap 0603)
C32  value 0.6pF  footprint: GRM0603  [CAPC1608X90N]  (hidden comment: Cap 0603)
C33  value 0.6pF  footprint: GRM0603  [CAPC1608X90N]  (hidden comment: Cap 0603)
C34  value 0.6pF  footprint: GRM0603  [CAPC1608X90N]  (hidden comment: Cap 0603)
C35  value 0.6pF  footprint: GRM0603  [CAPC1608X90N]  (hidden comment: Cap 0603)
C36  value 0.6pF  footprint: GRM0603  [CAPC1608X90N]  (hidden comment: Cap 0603)
C37  value 0.6pF  footprint: GRM0603  [CAPC1608X90N]  (hidden comment: Cap 0603)
C38  value 0.6pF  footprint: GRM0603  [CAPC1608X90N]  (hidden comment: Cap 0603)
C39  value 0.6pF  footprint: GRM0603  [CAPC1608X90N]  (hidden comment: Cap 0603)
C40  value 0.6pF  footprint: GRM0603  [CAPC1608X90N]  (hidden comment: Cap 0603)
C41  value 0.6pF  footprint: GRM0603  [CAPC1608X90N]  (hidden comment: Cap 0603)
C42  value 0.6pF  footprint: GRM0603  [CAPC1608X90N]  (hidden comment: Cap 0603)
IN_LNA  SMA  [SMA-142-0701-851]
L15  LQW18  value 8.2nHy  [INDC1608X100N]
L16  LQW18  value 12nHy  [INDC1608X100N]
OUT_LNA  SMA  [SMA-142-0701-851]
Q2  NPN  [SOT23_N_bfu550a]
R8  value 10 ohms  footprint: RMC0603  [RESC1508X55N]  (hidden comment: Resistor)
R9  value 10 ohms  footprint: RMC0603  [RESC1508X55N]  (hidden comment: Resistor)
R10  value 10 ohms  footprint: RMC0603  [RESC1508X55N]  (hidden comment: Resistor)
R11  value 10 ohms  footprint: RMC0603  [RESC1508X55N]  (hidden comment: Resistor)
R12  value 10 ohms  footprint: RMC0603  [RESC1508X55N]  (hidden comment: Resistor)
VCC_LNA  Header 3  [HDR1X3]

### Blocks framed on the sheet
Power Supply Filter: C30-C33 R8

### Ports
OUT_LNA (out)

### Nets
GND: C30.2 C31.2 C32.2 C33.2 C34.1 C35.1 C40.1 C41.1 C42.1 IN_LNA.2(Y) OUT_LNA.2(Y) Q2.2(E) R9.2 VCC_LNA.1 VCC_LNA.3
NetC30_1: C30.1 C31.1 R8.2 VCC_LNA.2
NetC32_1: C32.1 C33.1 R8.1 R10.2 R11.2
NetC34_2: C34.2 C35.2 L16.2 R9.1 R10.1
NetC36_1: C36.1 C37.1 L15.1 Q2.3(C)
NetC36_2: C36.2 R12.2
NetC37_2: C37.2 C41.2 OUT_LNA.1(X) ; port OUT_LNA
NetC38_1: C38.1 C39.2 C40.2 L16.1 Q2.1(B)
NetC38_2: C38.2 R12.1
NetC39_1: C39.1 C42.2 IN_LNA.1(X)
NetL15_2: L15.2 R11.1

### Layout directives
net class RF50R: GND

### Notes on the sheet
- LNA

### Library data of the parts
C30 = Cap Pol2_1: Polarized Capacitor (Axial); Published: 8-Jun-2000; LatestRevisionDate: 17-Jul-2002; LatestRevisionNote: Re-released for DXP Platform.; PackageReference: POLAR0.8; Publisher: Altium Limited; PackageDescription: Polarized Capacitor; 2 Leads; Value: 1uF
C31-C42 = Cap: Capacitor GRM18 0603; Published: 8-Jun-2000; LatestRevisionDate: 17-Jul-2002; LatestRevisionNote: Re-released for DXP Platform.; PackageReference: POLAR0.8; Publisher: Altium Limited; PackageDescription: Polarized Capacitor; 2 Leads; Supplier 1: Mouser
IN_LNA OUT_LNA = SMB: SMB Straight Connector; LatestRevisionDate: 17-Jul-2002; LatestRevisionNote: Re-released for DXP Platform.; Publisher: Altium Limited
L15 L16 = LQW18_1: Inductor LQW Package: 0603 (1608); MP: LQW18ANR47J00D; MF: Murata; Arrow_Electronics-Purchase-URL: https://snapeda.com/shop?store=Arrow+Electronics&id=1501811; Value: *; Availability: Good; Price: None; DigiKey-Purchase-URL: https://snapeda.com/shop?store=DigiKey&id=1501811; Package: 1608 Murata; SnapEDA_Link: https://www.snapeda.com/parts/LQW18ANR47J00D/Murata/view-part/1501811/?ref=snap; Mouser-Purchase-URL: https://snapeda.com/shop?store=Mouser&id=1501811
Q2 = BFU550A: NPN Bipolar Transistor; Published: 8-Jun-2000; LatestRevisionDate: 17-Jul-2002; LatestRevisionNote: Re-released for DXP Platform.; PackageReference: TO-226-AA; Publisher: Altium Limited; PackageDescription: TO, Flat Index; 3 In-Line, Axial Leads; Body Dia. 4.8mm; Leads 0.55 x 0.51 mm (max); Code_JEDEC: TO-226-AA
R8-R12 = Resistor: as R30 on sheet Completo
VCC_LNA = Header 3: Header, 3-Pin; LatestRevisionDate: 17-Jul-2002; LatestRevisionNote: Re-released for DXP Platform.; Publisher: Altium Limited

## Nets that join several sheets
GND: Completo (5 pins), VCO_BFP420 (14 pins), Directional_Coupler (16 pins), PowerAmplifier_BFU590G (14 pins), Amp_IF (20 pins), mixer_30mil_1GHz (18 pins), LNA_BFU550 (15 pins)
NetC4_1: Completo (R32.1), mixer_30mil_1GHz (C4.1 RF.1)
NetC6_1: Completo (R34.2), mixer_30mil_1GHz (C6.1 C10.2 L2.1 VLO.1)
NetC9_2: Completo (R31.2), mixer_30mil_1GHz (C9.2 IF.1 L5.2)
NetC18_1: Completo (R36.1), VCO_BFP420 (C18.1 OUT_VCO.1)
NetC27_1: Completo (R39.2), PowerAmplifier_BFU590G (C27.1 IN_PA.1)
NetC37_2: Completo (R33.2), LNA_BFU550 (C37.2 C41.2 OUT_LNA.1)
NetC43_1: Completo (R37.2), Directional_Coupler (C43.1 IN_C.1)
NetC50_2: Completo (R35.1), Directional_Coupler (C50.2 OUT_F.1)
NetIN_IF_1: Completo (R30.1), Amp_IF (IN_IF.1 R22.1)
NetOUT_C_1: Completo (R38.1), Directional_Coupler (OUT_C.1 U3.3)